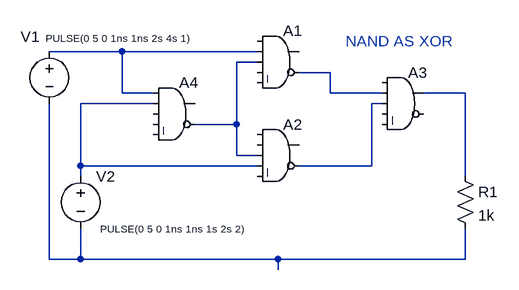
[diagram p0: schematic 204.asc]
204.asc, the LTspice schematic file:
Version 4
SHEET 1 880 680
WIRE 16 64 -96 64
WIRE 224 64 16 64
WIRE 224 80 192 80
WIRE 336 96 288 96
WIRE 16 128 16 64
WIRE 64 128 16 128
WIRE 336 128 336 96
WIRE 416 128 336 128
WIRE 544 128 480 128
WIRE 64 144 -48 144
WIRE 416 144 400 144
WIRE 192 176 192 80
WIRE 192 176 128 176
WIRE 192 224 192 176
WIRE 224 224 192 224
WIRE -48 240 -48 144
WIRE 224 240 -48 240
WIRE 400 240 400 144
WIRE 400 240 288 240
WIRE -48 256 -48 240
WIRE 544 256 544 128
WIRE -96 384 -96 144
WIRE -48 384 -48 336
WIRE -48 384 -96 384
WIRE 256 384 -48 384
WIRE 544 384 544 336
WIRE 544 384 256 384
WIRE 256 400 256 384
SYMBOL Digital\\and 256 16 R0
SYMATTR InstName A1
SYMBOL Digital\\and 256 160 R0
SYMATTR InstName A2
SYMBOL Digital\\and 448 80 R0
SYMATTR InstName A3
SYMBOL Digital\\and 96 96 R0
SYMATTR InstName A4
SYMBOL voltage -96 48 R0
WINDOW 0 -44 -7 Left 2
WINDOW 3 -6 -5 Left 1
WINDOW 123 0 0 Left 0
WINDOW 39 0 0 Left 0
SYMATTR InstName V1
SYMATTR Value PULSE(0 5 0 1ns 1ns 2s 4s 1)
SYMBOL voltage -48 240 R0
WINDOW 3 30 97 Left 1
WINDOW 123 0 0 Left 0
WINDOW 39 0 0 Left 0
SYMATTR InstName V2
SYMATTR Value PULSE(0 5 0 1ns 1ns 1s 2s 2)
SYMBOL res 528 240 R0
SYMATTR InstName R1
SYMATTR Value 1k
TEXT 360 48 Left 2 ;NAND AS XOR

The netlist it stands for:
* 204.asc
A1 0 N001 N002 0 0 N003 0 0 AND
A2 0 0 N002 N005 0 N006 0 0 AND
A3 0 N003 N006 0 0 0 N004 0 AND
A4 N001 N005 0 0 0 N002 0 0 AND
V1 N001 N007 PULSE(0 5 0 1ns 1ns 2s 4s 1)
V2 N005 N007 PULSE(0 5 0 1ns 1ns 1s 2s 2)
R1 N004 N007 1k
* NAND AS XOR
.backanno
.end